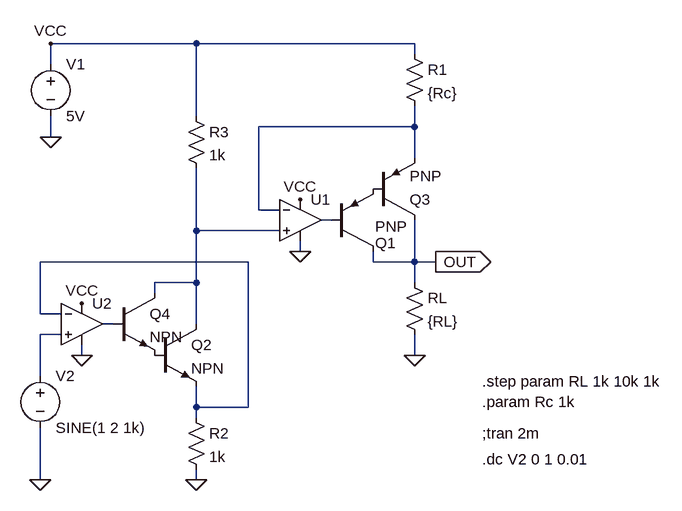
[diagram p0: schematic variable current Darington 5V.asc]
variable current Darington 5V.asc, the LTspice schematic file:
Version 4
SHEET 1 1180 692
WIRE 320 -32 96 -32
WIRE 656 -32 320 -32
WIRE 656 -16 656 -32
WIRE 96 0 96 -32
WIRE 320 80 320 -32
WIRE 656 96 656 64
WIRE 656 96 416 96
WIRE 96 112 96 80
WIRE 656 144 656 96
WIRE 416 224 416 96
WIRE 448 224 416 224
WIRE 528 240 512 240
WIRE 320 256 320 160
WIRE 448 256 320 256
WIRE 480 288 480 272
WIRE 400 304 80 304
WIRE 592 304 592 288
WIRE 656 304 656 240
WIRE 656 304 592 304
WIRE 688 304 656 304
WIRE 320 336 320 256
WIRE 320 336 256 336
WIRE 656 336 656 304
WIRE 256 352 256 336
WIRE 80 384 80 304
WIRE 112 384 80 384
WIRE 192 400 176 400
WIRE 320 400 320 336
WIRE 112 416 80 416
WIRE 144 448 144 432
WIRE 656 448 656 416
WIRE 80 480 80 416
WIRE 320 528 320 496
WIRE 400 528 400 304
WIRE 400 528 320 528
WIRE 320 544 320 528
WIRE 80 640 80 560
WIRE 320 640 320 624
FLAG 480 208 VCC
FLAG 656 448 0
FLAG 96 -32 VCC
FLAG 480 288 0
FLAG 96 112 0
FLAG 144 368 VCC
FLAG 144 448 0
FLAG 320 640 0
FLAG 80 640 0
FLAG 688 304 OUT
IOPIN 688 304 Out
SYMBOL Opamps\\UniversalOpamp2 480 240 R0
SYMATTR InstName U1
SYMBOL pnp 528 288 M180
WINDOW 0 67 13 Left 2
WINDOW 3 67 38 Left 2
SYMATTR InstName Q1
SYMBOL res 640 -32 R0
SYMATTR InstName R1
SYMATTR Value {Rc}
SYMBOL res 640 320 R0
SYMATTR InstName RL
SYMATTR Value {RL}
SYMBOL voltage 96 -16 R0
WINDOW 123 0 0 Left 2
WINDOW 39 0 0 Left 2
SYMATTR InstName V1
SYMATTR Value 5V
SYMBOL res 304 64 R0
SYMATTR InstName R3
SYMATTR Value 1k
SYMBOL npn 256 400 R0
SYMATTR InstName Q2
SYMBOL res 304 528 R0
SYMATTR InstName R2
SYMATTR Value 1k
SYMBOL Opamps\\UniversalOpamp2 144 400 R0
SYMATTR InstName U2
SYMBOL voltage 80 464 R0
WINDOW 123 0 0 Left 2
WINDOW 39 0 0 Left 2
SYMATTR InstName V2
SYMATTR Value SINE(1 2 1k)
SYMBOL pnp 592 240 M180
SYMATTR InstName Q3
SYMBOL npn 192 352 R0
SYMATTR InstName Q4
TEXT 760 568 Left 2 !;tran 2m
TEXT 760 488 Left 2 !.step param RL 1k 10k 1k
TEXT 760 608 Left 2 !.dc V2 0 1 0.01
TEXT 760 520 Left 2 !.param Rc 1k

The netlist it stands for:
* variable current Darington 5V.asc
XU1 N003 N001 VCC 0 N002 level.2 Avol=1Meg GBW=10Meg Slew=10Meg ilimit=25m rail=0 Vos=0 phimargin=45 en=0 enk=0 in=0 ink=0 Rin=500Meg  ; pins IN+ IN- V+ V- OUT
Q1 OUT N002 P001 0 PNP
R1 VCC N001 {Rc}
RL OUT 0 {RL}
V1 VCC 0 5V
R3 VCC N003 1k
Q2 N003 P002 N004 0 NPN
R2 N004 0 1k
XU2 N006 N004 VCC 0 N005 level.2 Avol=1Meg GBW=10Meg Slew=10Meg ilimit=25m rail=0 Vos=0 phimargin=45 en=0 enk=0 in=0 ink=0 Rin=500Meg  ; pins IN+ IN- V+ V- OUT
V2 N006 0 SINE(1 2 1k)
Q3 OUT P001 N001 0 PNP
Q4 N003 N005 P002 0 NPN
.model NPN NPN
.model PNP PNP
.lib standard.bjt
;tran 2m
.step param RL 1k 10k 1k
.dc V2 0 1 0.01
.param Rc 1k
.lib UniversalOpamps2.sub
.backanno
.end